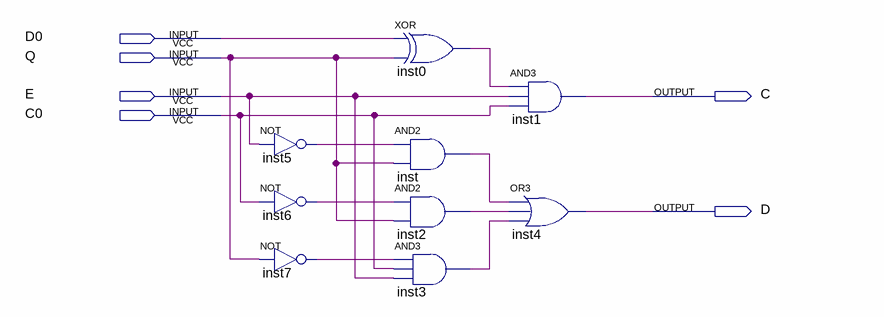
[diagram p0: schematic sheet]
// Quartus schematic HAS.bdf as structural Verilog: 9 symbols, 6 pins
module HAS (
  input  D0,
  input  Q,
  input  E,
  input  C0,
  output C,
  output D
);

  wire inst0_out, inst2_out, inst3_out, inst5_out, inst6_out, inst7_out, inst_out;

  not inst5 (inst5_out, E);
  not inst6 (inst6_out, C0);
  not inst7 (inst7_out, Q);
  xor inst0 (inst0_out, D0, Q);
  and inst (inst_out, inst5_out, Q);
  and inst2 (inst2_out, inst6_out, Q);
  and inst3 (inst3_out, inst7_out, C0, E);
  and inst1 (C, inst0_out, E, C0);
  or inst4 (D, inst_out, inst2_out, inst3_out);
endmodule
